# Altium schematic sheet [02]-BLOCK DIAGRAM.SchDoc: S32K1_CONTROLLER
size A3; SheetNumber: 02; SheetTotal: 11
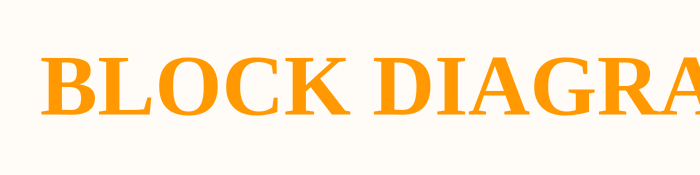
[diagram p0: [02]-BLOCK DIAGRAM.SchDoc]

## Notes on the sheet
- BLOCK DIAGRAM
- Title
- Size:
- Date:
- A3
- Number:
- Time:
- Revision:
- Sheet
- of
- File: